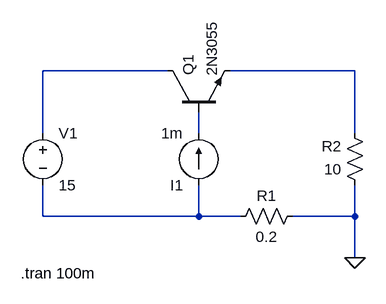
[diagram p0: schematic Draft1.asc]
Draft1.asc, the LTspice schematic file:
Version 4
SHEET 1 880 680
WIRE 320 -16 128 -16
WIRE 608 -16 416 -16
WIRE 128 80 128 -16
WIRE 368 80 368 48
WIRE 608 80 608 -16
WIRE 128 208 128 160
WIRE 368 208 368 160
WIRE 368 208 128 208
WIRE 432 208 368 208
WIRE 608 208 608 160
WIRE 608 208 512 208
WIRE 608 272 608 208
FLAG 608 272 0
SYMBOL voltage 128 64 R0
WINDOW 123 0 0 Left 2
WINDOW 39 0 0 Left 2
SYMATTR InstName V1
SYMATTR Value 15
SYMBOL npn 320 48 R270
SYMATTR InstName Q1
SYMATTR Value 2N3055
SYMBOL res 528 192 R90
WINDOW 0 0 56 VBottom 2
WINDOW 3 32 56 VTop 2
SYMATTR InstName R1
SYMATTR Value 0.2
SYMBOL res 624 176 R180
WINDOW 0 36 76 Left 2
WINDOW 3 36 40 Left 2
SYMATTR InstName R2
SYMATTR Value 10
SYMBOL load2 368 160 R180
WINDOW 123 0 0 Left 2
WINDOW 39 0 0 Left 2
SYMATTR InstName I1
SYMATTR Value 1m
TEXT 94 296 Left 2 !.tran 100m

The netlist it stands for:
* Draft1.asc
V1 N001 N004 15
Q1 N001 N003 N002 0 2N3055
R1 0 N004 0.2
R2 0 N002 10
I1 N004 N003 1m
.model NPN NPN
.model PNP PNP
.lib standard.bjt
.tran 100m
.backanno
.end